# EAGLE design Wifi Board Rework (EAGLE 9.4.2)
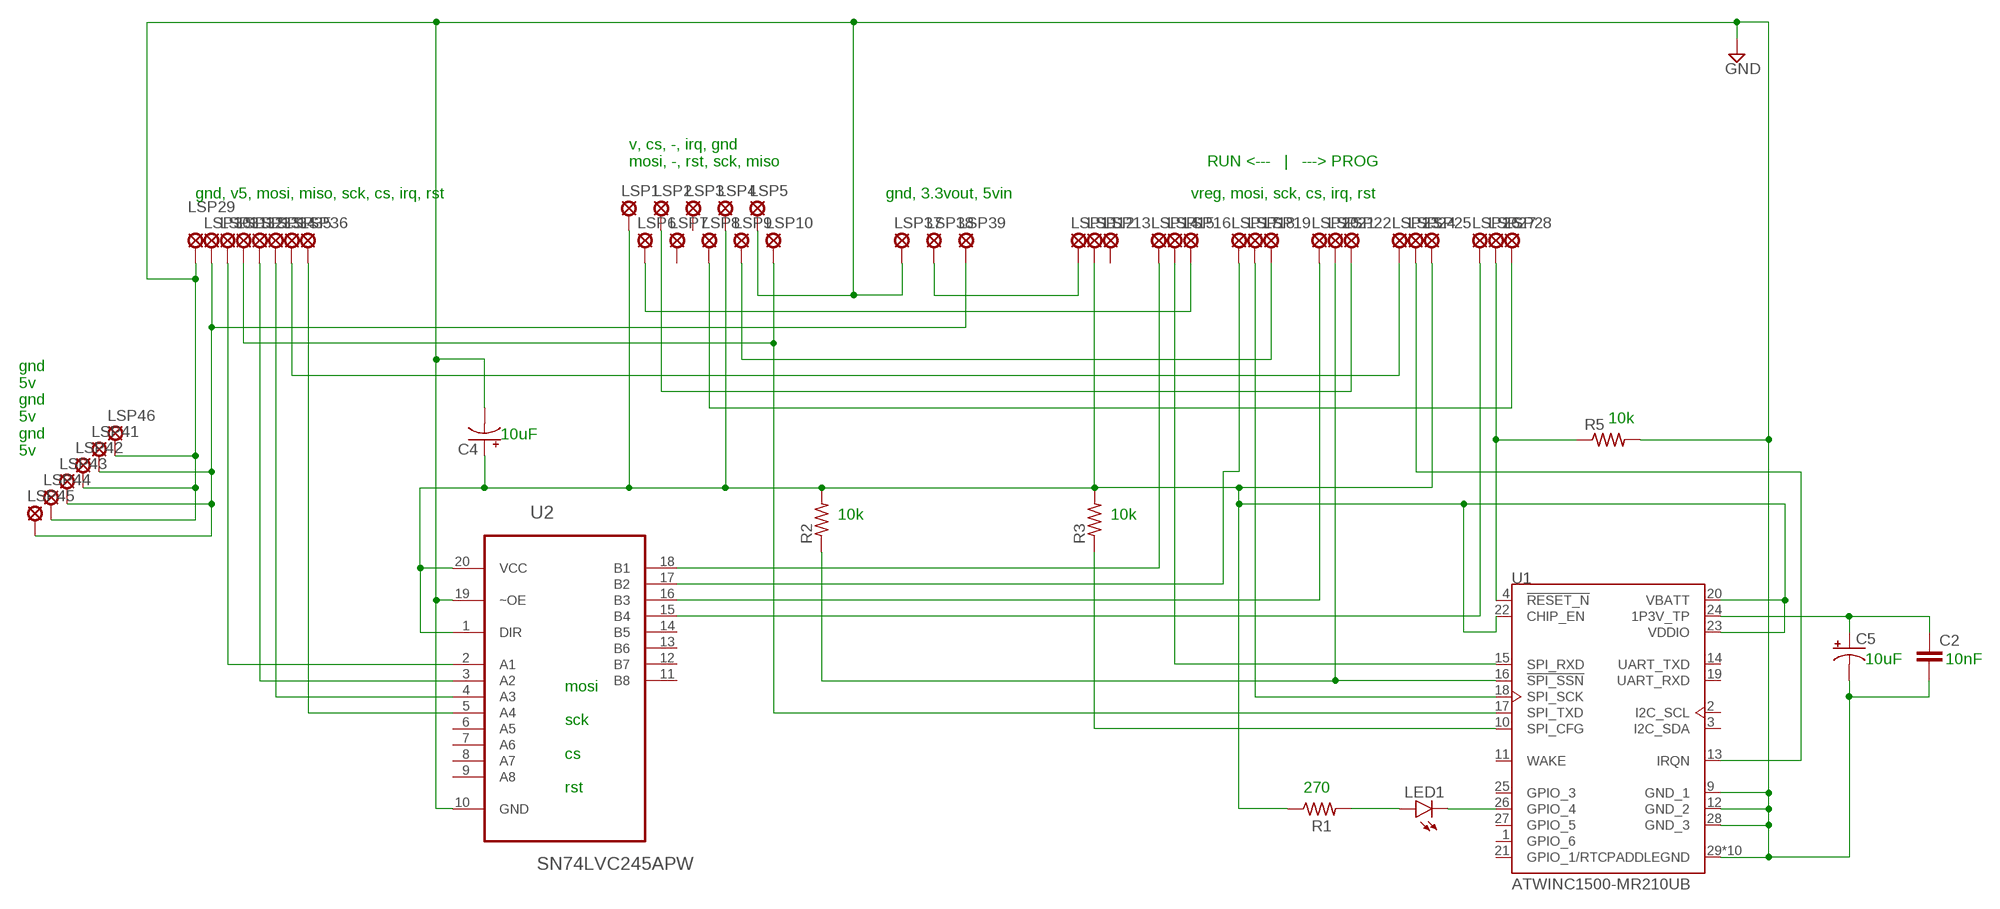
[diagram p0: schematic, sheet 1]

## Parts
C2  C5/2.5  [C5B2.5]
C4  CPOL-USE2-4  [E2-4]
C5  CPOL-USE2-4  [E2-4]
LED1  LED5MM  [LED5MM]
LSP1  LSP10_CLSP10_C  [LSP10_C]
LSP2  LSP10_CLSP10_C  [LSP10_C]
LSP3  LSP10_CLSP10_C  [LSP10_C]
LSP4  LSP10_CLSP10_C  [LSP10_C]
LSP5  LSP10_CLSP10_C  [LSP10_C]
LSP6  LSP10_S  [LSP10_S]
LSP7  LSP10_CLSP10_C  [LSP10_C]
LSP8  LSP10_CLSP10_C  [LSP10_C]
LSP9  LSP10_CLSP10_C  [LSP10_C]
LSP10  LSP10_CLSP10_C  [LSP10_C]
LSP11  LSP10_CLSP10_C  [LSP10_C]
LSP12  LSP10_CLSP10_C  [LSP10_C]
LSP13  LSP10_CLSP10_C  [LSP10_C]
LSP14  LSP10_CLSP10_C  [LSP10_C]
LSP15  LSP10_CLSP10_C  [LSP10_C]
LSP16  LSP10_CLSP10_C  [LSP10_C]
LSP17  LSP10_CLSP10_C  [LSP10_C]
LSP18  LSP10_CLSP10_C  [LSP10_C]
LSP19  LSP10_CLSP10_C  [LSP10_C]
LSP20  LSP10_CLSP10_C  [LSP10_C]
LSP21  LSP10_CLSP10_C  [LSP10_C]
LSP22  LSP10_CLSP10_C  [LSP10_C]
LSP23  LSP10_CLSP10_C  [LSP10_C]
LSP24  LSP10_CLSP10_C  [LSP10_C]
LSP25  LSP10_CLSP10_C  [LSP10_C]
LSP26  LSP10_CLSP10_C  [LSP10_C]
LSP27  LSP10_CLSP10_C  [LSP10_C]
LSP28  LSP10_CLSP10_C  [LSP10_C]
LSP29  LSP10_S  [LSP10_S]
LSP30  LSP10_CLSP10_C  [LSP10_C]
LSP31  LSP10_CLSP10_C  [LSP10_C]
LSP32  LSP10_CLSP10_C  [LSP10_C]
LSP33  LSP10_CLSP10_C  [LSP10_C]
LSP34  LSP10_CLSP10_C  [LSP10_C]
LSP35  LSP10_CLSP10_C  [LSP10_C]
LSP36  LSP10_CLSP10_C  [LSP10_C]
LSP37  LSP10_S  [LSP10_S]
LSP38  LSP10_CLSP10_C  [LSP10_C]
LSP39  LSP10_CLSP10_C  [LSP10_C]
LSP41  LSP10_CLSP10_C  [LSP10_C]
LSP42  LSP10_CLSP10_C  [LSP10_C]
LSP43  LSP10_CLSP10_C  [LSP10_C]
LSP44  LSP10_CLSP10_C  [LSP10_C]
LSP45  LSP10_CLSP10_C  [LSP10_C]
LSP46  LSP10_S  [LSP10_S]
R1  R-US_VMTA55  [VMTA55]
R2  R-US_VMTA55  [VMTA55]
R3  R-US_VMTA55  [VMTA55]
R5  R-US_VMTA55  [VMTA55]
U1  ATWINC1500-MR210UB  [MICROCHIP_ATWINC1500-MR210UB]
U2  SN74LVC245APW  [SOP65P640X120-20N]

## Nets
GND: C2.2 C4.- C5.- LSP5.P$1(MP) LSP29.P$1(MP) LSP37.P$1(MP) LSP42.P$1(MP) LSP44.P$1(MP) LSP46.P$1(MP) R5.2 U1.9(GND_1) U1.12(GND_2) U1.28(GND_3) U1.29(PADDLEGND) U1.P$1(PADDLEGND) U1.P$2(PADDLEGND) U1.P$3(PADDLEGND) U1.P$4(PADDLEGND) U1.P$5(PADDLEGND) U1.P$6(PADDLEGND) U1.P$7(PADDLEGND) U1.P$8(PADDLEGND) U1.P$9(PADDLEGND) U2.10(GND) U2.19(~OE)
N$1: LED1.K(C) U1.26(GPIO_4)
N$2: LED1.A R1.2
N$3: C4.+ LSP1.P$1(MP) LSP4.P$1(MP) LSP12.P$1(MP) LSP25.P$1(MP) R1.1 R2.2 R3.2 U1.20(VBATT) U1.22(CHIP_EN) U1.23(VDDIO) U2.1(DIR) U2.20(VCC)
N$4: LSP11.P$1(MP) LSP38.P$1(MP)
N$5: R3.1 U1.10(SPI_CFG)
N$6: LSP10.P$1(MP) LSP32.P$1(MP) U1.17(SPI_TXD)
N$7: LSP30.P$1(MP) LSP39.P$1(MP) LSP41.P$1(MP) LSP43.P$1(MP) LSP45.P$1(MP)
N$8: LSP23.P$1(MP) LSP35.P$1(MP)
N$9: LSP15.P$1(MP) U1.15(SPI_RXD)
N$10: LSP6.P$1(MP) LSP16.P$1(MP)
N$11: LSP9.P$1(MP) LSP19.P$1(MP)
N$12: LSP2.P$1(MP) LSP22.P$1(MP)
N$13: LSP24.P$1(MP) U1.13(IRQN)
N$14: C2.1 C5.+ U1.24(1P3V_TP)
N$15: LSP14.P$1(MP) U2.18(B1)
N$16: LSP17.P$1(MP) U2.17(B2)
N$17: LSP20.P$1(MP) U2.16(B3)
N$18: LSP26.P$1(MP) U2.15(B4)
N$19: LSP27.P$1(MP) R5.1 U1.4(!RESET_N)
N$20: LSP34.P$1(MP) U2.4(A3)
N$21: LSP18.P$1(MP) U1.18(SPI_SCK)
N$22: LSP21.P$1(MP) R2.1 U1.16(!SPI_SSN)
N$23: LSP36.P$1(MP) U2.5(A4)
N$24: LSP33.P$1(MP) U2.3(A2)
N$25: LSP31.P$1(MP) U2.2(A1)
N$26: LSP8.P$1(MP) LSP28.P$1(MP)
Unconnected: LSP3.P$1(MP) LSP7.P$1(MP) LSP13.P$1(MP) U1.1(GPIO_6) U1.2(I2C_SCL) U1.3(I2C_SDA) U1.11(WAKE) U1.14(UART_TXD) U1.19(UART_RXD) U1.21(GPIO_1/RTC) U1.25(GPIO_3) U1.27(GPIO_5) U2.6(A5) U2.7(A6) U2.8(A7) U2.9(A8) U2.11(B8) U2.12(B7) U2.13(B6) U2.14(B5)

## Notes on the sheet
- v, cs, -, irq, gnd
  mosi, -, rst, sck, miso
- RUN <---   |   ---> PROG
- gnd, v5, mosi, miso, sck, cs, irq, rst | gnd, 3.3vout, 5vin | vreg, mosi, sck, cs, irq, rst
- 10k
- 10uF
- gnd
  5v
  gnd
  5v
  gnd
  5v
- 10k | 10k
- 10uF | 10nF
- mosi
  
  sck
  
  cs
  
  rst
- 270

## Library data of the parts
C2 = capacitor-wima:C: CAPACITOR naming: grid - package width
C4 C5 = rcl:CPOL-US: POLARIZED CAPACITOR, American symbol; SPICEPREFIX: C
LED1 = led:LED: LED OSRAM: - CHIPLED LG R971, LG N971, LY N971, LG Q971, LY Q971, LO R971, LY R971 LH N974, LH R974 LS Q976, LO Q976, LY Q976 LO Q996 - Hyper CHIPLED LW Q18S LB Q993, LB Q99A, LB R99A - SideLED LS A670, LO A670, LY A670, LG A670, LP A670 LB A673, LV A673, LT A673, LW A673 LH A674 LY A675 LS A676, LA A676, LO A676, LY A676, LW A676 LS A679, LY A679, LG A679 - Hyper Micro SIDELED® LS Y876, LA Y876, LO Y876, LY Y876 LT Y87S - SmartLED LW L88C, LW L88S LB L89C, LB L89S, LG L890 LS L89K, LO L89K, LY L89K LS L896, LA L896, LO L896, LY L896 - TOPLED LS T670, LO T670, LY T670, LG T670, LP T670 LSG T670, LSP T670, LSY T670, LOP T670, LYG T670 LG T671, LOG T671, LSG T671 LB T673, LV T673, LT T673, LW T673 LH T674 LS T676, LA T676, LO T676, LY T676, LB T676, LH T676, LSB T676, LW T676 LB T67C, LV T67C, LT T67C, LS T67K, LO T67K, LY T67K, LW E67C LS E67B, LA E67B, LO E67B, LY E67B, LB E67C, LV E67C, LT E67C LW T67C LS T679, LY T679, LG T679 LS T770, LO T770, LY T770, LG T770, LP T770 LB T773, LV T773, LT T773, LW T773 LH T774 LS E675, LA E675, LY E675, LS T675 LS T776, LA T776, LO T776, LY T776, LB T776 LHGB T686 LT T68C, LB T68C - Hyper Mini TOPLED® LB M676 - Mini TOPLED Santana® LG M470 LS M47K, LO M47K, LY M47K Source: http://www.osram.convergy.de LUXEON: - LUMILED® LXK2-PW12-R00, LXK2-PW12-S00, LXK2-PW14-U00, LXK2-PW14-V00 LXK2-PM12-R00, LXK2-PM12-S00, LXK2-PM14-U00 LXK2-PE12-Q00, LXK2-PE12-R00, LXK2-PE12-S00, LXK2-PE14-T00, LXK2-PE14-U00 LXK2-PB12-K00, LXK2-PB12-L00, LXK2-PB12-M00, LXK2-PB14-N00, LXK2-PB14-P00, LXK2-PB14-Q00 LXK2-PR12-L00, LXK2-PR12-M00, LXK2-PR14-Q00, LXK2-PR14-R00 LXK2-PD12-Q00, LXK2-PD12-R00, LXK2-PD12-S00 LXK2-PH12-R00, LXK2-PH12-S00 LXK2-PL12-P00, LXK2-PL12-Q00, LXK2-PL12-R00 Source: www.luxeon.com KINGBRIGHT: KA-3528ASYC Source: www.kingbright.com
LSP1-LSP5 LSP7-LSP28 LSP30-LSP36 LSP38 LSP39 LSP41-LSP45 = tbtaco-solpad:LSP10_C: SOLDER PAD drill 1.0 mm, distributor Buerklin, 12H555
LSP6 LSP29 LSP37 LSP46 = tbtaco-solpad:LSP10_S: SOLDER PAD drill 1.0 mm, distributor Buerklin, 12H555
R1-R3 R5 = rcl:R-US_: RESISTOR, American symbol; SPICEPREFIX: R
U1 = ATWINC1500-MR210UB:ATWINC1500-MR210UB: SmartConnect ATWINC1500B-MU-T Module - SmartConnect ATWINC1500B-MU-T Module/ MODULE (R3); AVAILABILITY: Unavailable; DESCRIPTION: SmartConnect ATWINC1500B-MU-T Module - SmartConnect ATWINC1500B-MU-T Module/ MODULE _R3_; MF: Microchip; MP: ATWINC1500-MR210UB; PACKAGE: Module Microchip; PRICE: None
U2 = SN74LVC245APW:SN74LVC245APW: OCTAL BUS TRANSCEIVER WITH 3-STATE OUTPUTS; AVAILABILITY: Unavailable; DESCRIPTION: Octal Bus Transceiver With 3-State Outputs 20-TSSOP -40 to 125; MF: Texas Instruments; MP: SN74LVC245APW; PACKAGE: TSSOP-20 Texas Instruments; PRICE: None

## Board
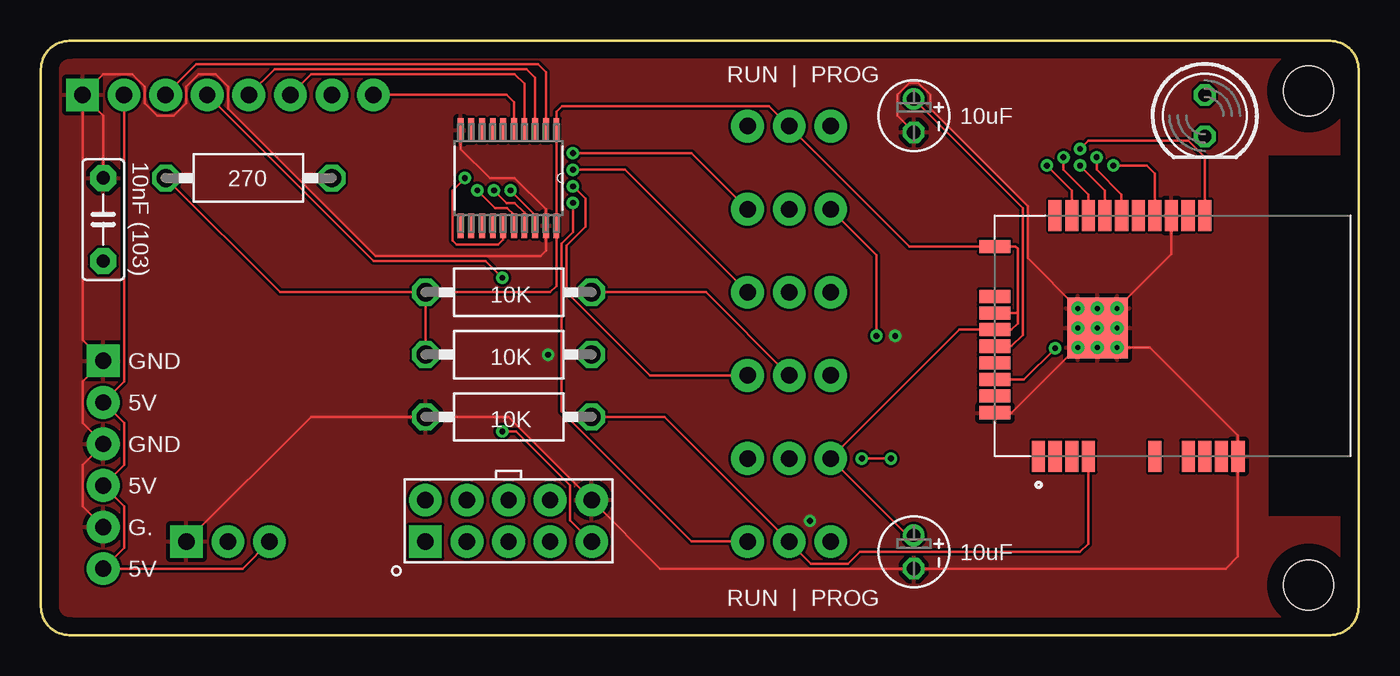
[diagram p1: board, top side]
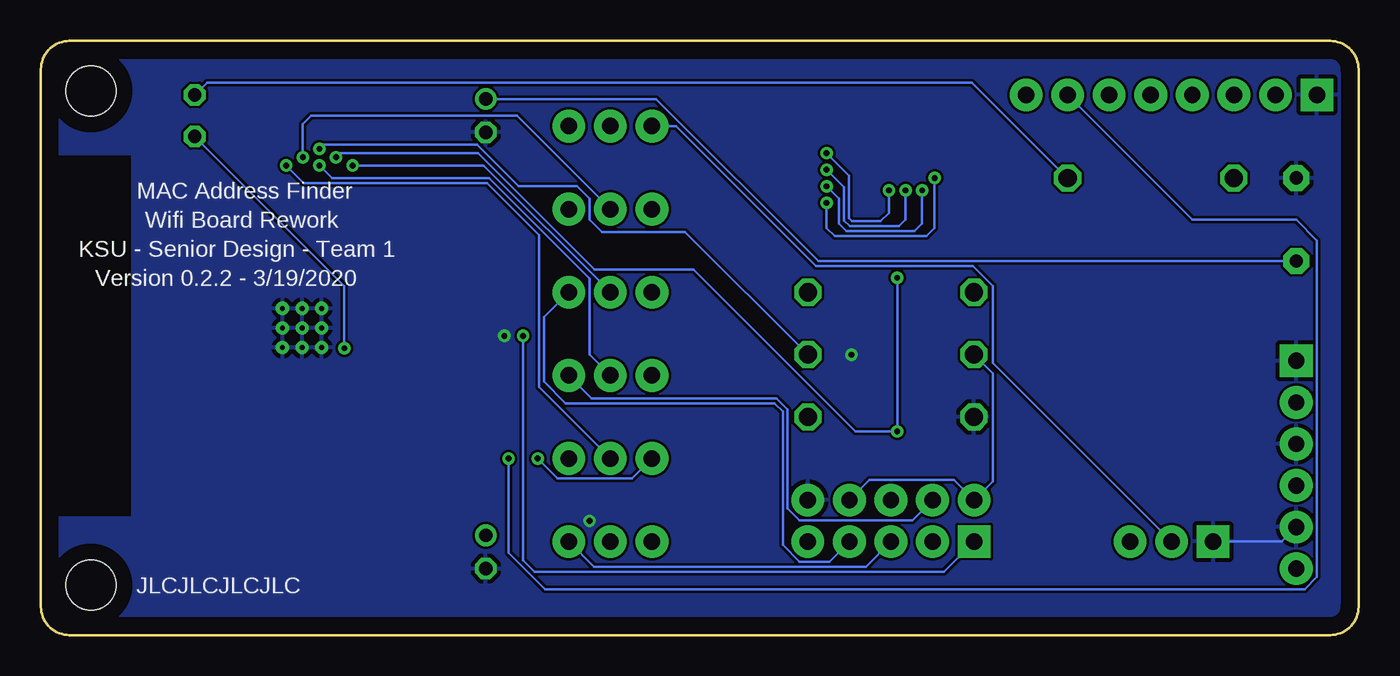
[diagram p2: board, bottom side, seen from below]

Size 80.52 x 36.32 mm. Coordinates in mm from the lower left corner, seen from the top.
Outline: 0,34.59 0,1.73 arc90 1.73,0 78.78,0 arc90 80.52,1.73 80.52,34.59 arc90 78.78,36.32 1.73,36.32 arc90 0,34.59
Copper layers (1*16): Top 0.035mm / dielectric 1.5mm / Bottom 0.035mm
Design rules "default": minimum track width 6mil, minimum drill 0.35mm, track to track 6mil, track to pad 6mil, pad to pad 6mil, via to via 6mil, smd to smd 6mil, copper to edge 40mil, drill to drill 6mil, minimum pad ring 10mil, minimum via ring 8mil, stop-mask expansion 4mil, vias tented up to drill 0mil, thermal gap 10mil
Holes 3.05 mm at 77.47,33.27 77.47,3.05

### Footprints (pad centres in the part's own frame; a part is rotated, then mirrored left to right if it is on the bottom)
C5B2.5 = drill 0.813 pad 1.6 octagon: 1 -2.54,0; 2 2.54,0
E2-4 = drill 0.813 pad 1.27: + -1.016,0 | drill 0.813 pad 1.27 octagon: - 1.016,0
LED5MM = drill 0.813 octagon: A -1.27,0; K 1.27,0
LSP10_C = drill 1 pad 2: P$1 0,0
LSP10_S = drill 1 pad 2 square: P$1 0,0
VMTA55 = drill 1.1 octagon: 1 -5.08,0; 2 5.08,0
MICROCHIP_ATWINC1500-MR210UB = smd 1.9 x 0.8: 1 7.365,0; 2 7.365,1.016; 3 7.365,2.032; 4 7.365,3.048; 5 7.365,7.112; 6 7.365,9.144; 7 7.365,10.16; 8 7.365,11.176; 9 7.365,12.192; 10 -7.365,10.154; 11 -7.365,9.138; 12 -7.365,8.122; 13 -7.365,7.106; 14 -7.365,6.09; 15 -7.365,5.074; 16 -7.365,4.058; 17 -7.365,3.042; 18 -7.365,2.026; 19 -7.365,1.01 | smd 0.8 x 1.9: 20 -5.465,-2.67; 21 -2.417,-2.67; 22 -1.401,-2.67; 23 -0.385,-2.67; 24 0.631,-2.67; 25 1.647,-2.67; 26 2.663,-2.67; 27 3.679,-2.67; 28 4.695,-2.67 | smd 3.7 x 3.7: 29 -0.485,3.6 | drill 0.3 pad 0.5: P$1 -0.485,3.6; P$2 -1.685,3.6; P$3 0.715,3.6; P$4 -1.685,4.8; P$5 -0.485,4.8; P$6 0.715,4.8; P$7 -1.685,2.4; P$8 -0.485,2.4; P$9 0.715,2.4
SOP65P640X120-20N = smd 1.473 x 0.356: 1 -2.921,2.921; 2 -2.921,2.286; 3 -2.921,1.626; 4 -2.921,0.965; 5 -2.921,0.33; 6 -2.921,-0.33; 7 -2.921,-0.965; 8 -2.921,-1.626; 9 -2.921,-2.286; 10 -2.921,-2.921; 11 2.921,-2.921; 12 2.921,-2.286; 13 2.921,-1.626; 14 2.921,-0.965; 15 2.921,-0.33; 16 2.921,0.33; 17 2.921,0.965; 18 2.921,1.626; 19 2.921,2.286; 20 2.921,2.921

### Placement (x,y rotation side)
C2  3.81,25.4 90 top
C4  53.34,5.08 270 top
C5  53.34,31.75 270 top
LED1  71.12,31.75 270 top
LSP1  23.5,8.26 0 top
LSP2  26.04,8.26 0 top
LSP3  28.57,8.26 0 top
LSP4  31.11,8.26 0 top
LSP5  33.66,8.26 0 top
LSP6  23.5,5.71 0 top
LSP7  26.04,5.71 0 top
LSP8  28.57,5.71 0 top
LSP9  31.11,5.71 0 top
LSP10  33.66,5.71 0 top
LSP11  43.18,31.11 0 top
LSP12  45.72,31.11 0 top
LSP13  48.26,31.11 0 top
LSP14  43.18,26.04 0 top
LSP15  45.72,26.04 0 top
LSP16  48.26,26.04 0 top
LSP17  43.18,20.95 0 top
LSP18  45.72,20.95 0 top
LSP19  48.26,20.95 0 top
LSP20  43.18,15.88 0 top
LSP21  45.72,15.88 0 top
LSP22  48.26,15.88 0 top
LSP23  43.18,10.79 0 top
LSP24  45.72,10.79 0 top
LSP25  48.26,10.79 0 top
LSP26  43.18,5.71 0 top
LSP27  45.72,5.71 0 top
LSP28  48.26,5.71 0 top
LSP29  2.54,33.02 0 top
LSP30  5.08,33.02 0 top
LSP31  7.62,33.02 0 top
LSP32  10.16,33.02 0 top
LSP33  12.7,33.02 0 top
LSP34  15.24,33.02 0 top
LSP35  17.78,33.02 0 top
LSP36  20.32,33.02 0 top
LSP37  8.89,5.71 0 top
LSP38  11.43,5.71 0 top
LSP39  13.97,5.71 0 top
LSP41  3.81,14.22 0 top
LSP42  3.81,11.68 0 top
LSP43  3.81,9.14 0 top
LSP44  3.81,6.6 0 top
LSP45  3.81,4.06 0 top
LSP46  3.81,16.76 0 top
R1  12.7,27.94 0 top
R2  28.57,20.95 180 top
R3  28.57,17.14 180 top
R5  28.57,13.34 180 top
U1  60.96,18.29 270 top
U2  28.57,27.94 270 top

### Tracks (layer width: path | path; a pad name or v marks a point on that pad's centre or on a via)
GND  (via drill 0.35)
  Top 0.152: LSP29.P$1 3.81,31.75 C2.2 | LSP44.P$1 2.54,7.87 2.54,10.41 LSP42.P$1 2.54,12.95 2.54,15.49 LSP46.P$1 2.54,18.03 LSP29.P$1 | LSP37.P$1 16.51,13.34 R5.2 28.57,13.34 LSP5.P$1 37.85,4.06 C4.- 72.39,4.06 73.15,4.83 U1.9 73.15,12.19 67.77,17.57 U1.P$6 U1.P$1 | U2.10 25.65,29.72 27.43,27.94 28.96,27.94 30.86,26.04 U2.19 30.86,23.5 30.53,23.16 20.45,23.16 11.43,32.18 11.43,33.53 10.67,34.29 9.65,34.29 8.89,33.53 8.89,32.51 8.13,31.75 7.11,31.75 6.35,32.51 6.35,33.53 5.59,34.29 3.81,34.29 LSP29.P$1 | U1.12 69.08,23.3 U1.P$4 U1.P$1 | U1.28 59.31,13.59 63.29,17.57 U1.P$9 U1.P$1 | C5.- 52.32,31.75 52.32,33.02 53.09,33.78 53.59,33.78 54.36,33.02 54.36,32.18 60.3,26.24 60.3,23.03 U1.P$7 U1.P$1 | U1.P$1 U1.P$2 | U1.P$1 U1.P$5 | U1.P$1 U1.P$3 | U1.P$1 U1.P$8
  Bottom 0.152: LSP37.P$1 4.7,5.71 LSP44.P$1
  other vias: 30.99,17.14 52.2,18.29 46.99,6.99
  pour Top: 0,36.32 80.52,36.32 80.52,33.53 80.52,0 0,0
  pour Bottom: 0,36.32 80.52,36.32 80.52,0 0,0
N$1  (via drill 0.35)
  Top 0.152: U1.26 60.08,15.62 v61.98,17.53
  Bottom 0.152: v61.98,17.53 61.98,21.34 LED1.K
N$2
  Bottom 0.152: R1.2 23.62,33.78 70.36,33.78 LED1.A
N$3
  Top 0.152: R2.2 R3.2 | R2.2 14.61,20.95 R1.1 | 59.69,19.81 59.69,23.62 59.56,23.75 U1.20 53.08,23.75 LSP12.P$1 44.49,32.34 31.84,32.34 31.5,32 U2.1 U2.20 31.5,21.34 31.11,20.95 R2.2 | 59.69,19.81 59.69,19.05 59.31,18.67 U1.23 56.14,18.67 LSP25.P$1 52.96,6.1 C4.+ | U1.22 59.57,19.69 59.69,19.81
  Bottom 0.152: R3.2 22.35,16 22.35,9.4 LSP1.P$1 24.72,9.48 29.89,9.48 LSP4.P$1
N$4
  Bottom 0.152: LSP38.P$1 22.35,16.64 22.35,21.34 23.57,22.55 33.15,22.55 41.71,31.11 LSP11.P$1
N$5  (via drill 0.35)
  Top 0.152: v63.5,29.72 64.01,30.23 70.1,30.23 71.11,29.22 U1.10
  Bottom 0.152: v63.5,29.72 63.25,29.97 53.88,29.97 51.34,27.43 47.75,27.43 46.99,26.67 46.99,25.4 46.23,24.64 41.15,24.64 R3.1
N$6  (via drill 0.35)
  Top 0.152: U1.17 64,26.93 62.48,28.45 v62.48,29.21 | v28.19,12.45 29.03,12.45 32.34,9.13 32.34,7.03 LSP10.P$1 | LSP32.P$1 20.32,22.86 27.18,22.86 v28.19,21.84
  Bottom 0.152: v62.48,29.21 62.23,29.46 53.8,29.46 46.69,22.35 40.64,22.35 30.73,12.45 v28.19,12.45 v28.19,21.84
N$7
  Top 0.152: LSP39.P$1 12.32,4.06 LSP45.P$1 5.08,5.33 5.08,7.87 LSP43.P$1 5.08,10.41 5.08,12.95 LSP41.P$1 5.08,15.49 LSP30.P$1
N$8  (via drill 0.35)
  Top 0.152: v50.16,10.79 v51.94,10.79
  Bottom 0.152: LSP35.P$1 10.16,25.4 3.81,25.4 2.54,24.13 2.54,3.56 3.3,2.79 49.71,2.79 51.94,5.03 v51.94,10.79 | LSP23.P$1 44.41,9.57 48.94,9.57 v50.16,10.79
N$9  (via drill 0.35)
  Top 0.152: U1.15 66.03,26.93 64.52,28.45 v64.52,29.21
  Bottom 0.152: LSP15.P$1 51.44,31.75 64.01,31.75 64.52,31.24 v64.52,29.21
N$10  (via drill 0.35)
  Top 0.152: LSP16.P$1 51.05,23.24 v51.05,18.29
  Bottom 0.152: v51.05,18.29 51.05,4.57 50.36,3.88 25.33,3.88 LSP6.P$1
N$11
  Bottom 0.152: LSP9.P$1 32.34,4.49 34.16,4.49 35.19,5.51 35.19,13.68 35.69,14.17 48.46,14.17 49.78,15.49 49.78,19.43 LSP19.P$1
N$12
  Bottom 0.152: LSP2.P$1 27.26,7.03 34.16,7.03 34.88,7.75 34.88,13.8 35.56,14.48 46.86,14.48 LSP22.P$1
N$13  (via drill 0.35)
  Top 0.152: U1.13 68.07,28.2 67.56,28.7 v65.53,28.7
  Bottom 0.152: LSP24.P$1 50.09,15.16 50.09,24.46 53.26,27.64 64.47,27.64 v65.53,28.7
N$14
  Top 0.152: U1.24 59.31,17.66 59.99,18.34 59.99,26.11 C5.+
  Bottom 0.152: C2.1 33.02,22.86 42.93,32.77 C5.+
N$15  (via drill 0.35)
  Top 0.152: U2.18 30.2,25.68 v28.7,27.18 | v32.51,29.46 39.75,29.46 LSP14.P$1
  Bottom 0.152: v28.7,27.18 28.7,25.81 29.21,25.3 30.96,25.3 31.14,25.48 31.14,28.09 v32.51,29.46
N$16  (via drill 0.35)
  Top 0.152: U2.17 29.54,25.83 28.96,26.42 28.45,26.42 v27.69,27.18 | v32.51,28.45 35.69,28.45 LSP17.P$1
  Bottom 0.152: v27.69,27.18 27.69,25.4 28.09,24.99 31.09,24.99 31.45,25.35 31.45,27.38 v32.51,28.45
N$17  (via drill 0.35)
  Top 0.152: U2.16 28.91,25.7 28.5,26.11 27.74,26.11 v26.67,27.18 | v32.51,27.43 33.27,26.67 33.27,24.97 32.11,23.8 32.11,20.98 37.21,15.88 LSP20.P$1
  Bottom 0.152: v26.67,27.18 26.67,25.15 27.13,24.69 31.29,24.69 31.75,25.15 31.75,26.67 v32.51,27.43
N$18  (via drill 0.35)
  Top 0.152: U2.15 28.25,24.18 27.94,23.88 25.4,23.88 25.15,24.13 25.15,27.18 v25.91,27.94 | v32.51,26.42 32.51,24.64 31.8,23.93 31.8,13.66 39.75,5.71 LSP26.P$1
  Bottom 0.152: v25.91,27.94 25.91,24.89 26.42,24.38 32,24.38 32.51,24.89 v32.51,26.42
N$19
  Top 0.152: R5.1 38.1,13.34 LSP27.P$1 47.07,4.37 49.33,4.37 50.04,5.08 63.5,5.08 64.01,5.59 U1.4
N$20
  Top 0.152: LSP34.P$1 16.51,34.29 28.96,34.29 29.54,33.71 U2.4
N$21  (via drill 0.35)
  Top 0.152: U1.18 62.99,27.18 v61.47,28.7
  Bottom 0.152: LSP18.P$1 53.47,28.7 v61.47,28.7
N$22  (via drill 0.35)
  Top 0.152: U1.16 65.02,27.18 v63.5,28.7 | R2.1 40.64,20.95 LSP21.P$1
  Bottom 0.152: LSP21.P$1 46.99,17.14 46.99,21.79 53.14,27.94 62.74,27.94 v63.5,28.7
N$23
  Top 0.152: LSP36.P$1 28.45,33.02 28.91,32.56 U2.5
N$24
  Top 0.152: LSP33.P$1 14.28,34.59 29.67,34.59 30.2,34.06 U2.3
N$25
  Top 0.152: LSP31.P$1 9.5,34.9 30.38,34.9 30.86,34.42 U2.2
N$26
  Bottom 0.152: LSP8.P$1 30.11,4.18 46.73,4.18 LSP28.P$1

### Text on the board
tPlace: RUN | PROG | 10uF | 10nF (103) | 270 | 10K | 10K | GND | 5V | 10K | GND | 5V | G. | 10uF | 5V | RUN | PROG
bPlace: MAC Address Finder | Wifi Board Rework | KSU - Senior Design - Team 1 | Version 0.2.2 - 3/19/2020 | JLCJLCJLCJLC